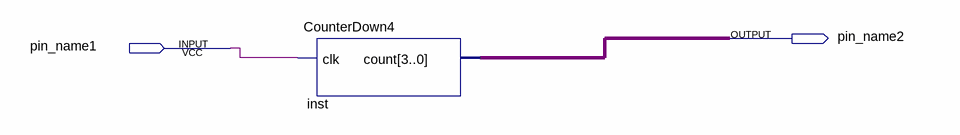
[diagram p0: schematic sheet]
// Quartus schematic Counter_Demo.bdf as structural Verilog: 1 symbols, 2 pins
module Counter_Demo (
  input  pin_name1,
  output pin_name2
);

  wire [3:0] inst_count;

  CounterDown4 inst (.clk(pin_name1), .count(inst_count));
endmodule
